# EAGLE design USB Sentinel (EAGLE 6.4)
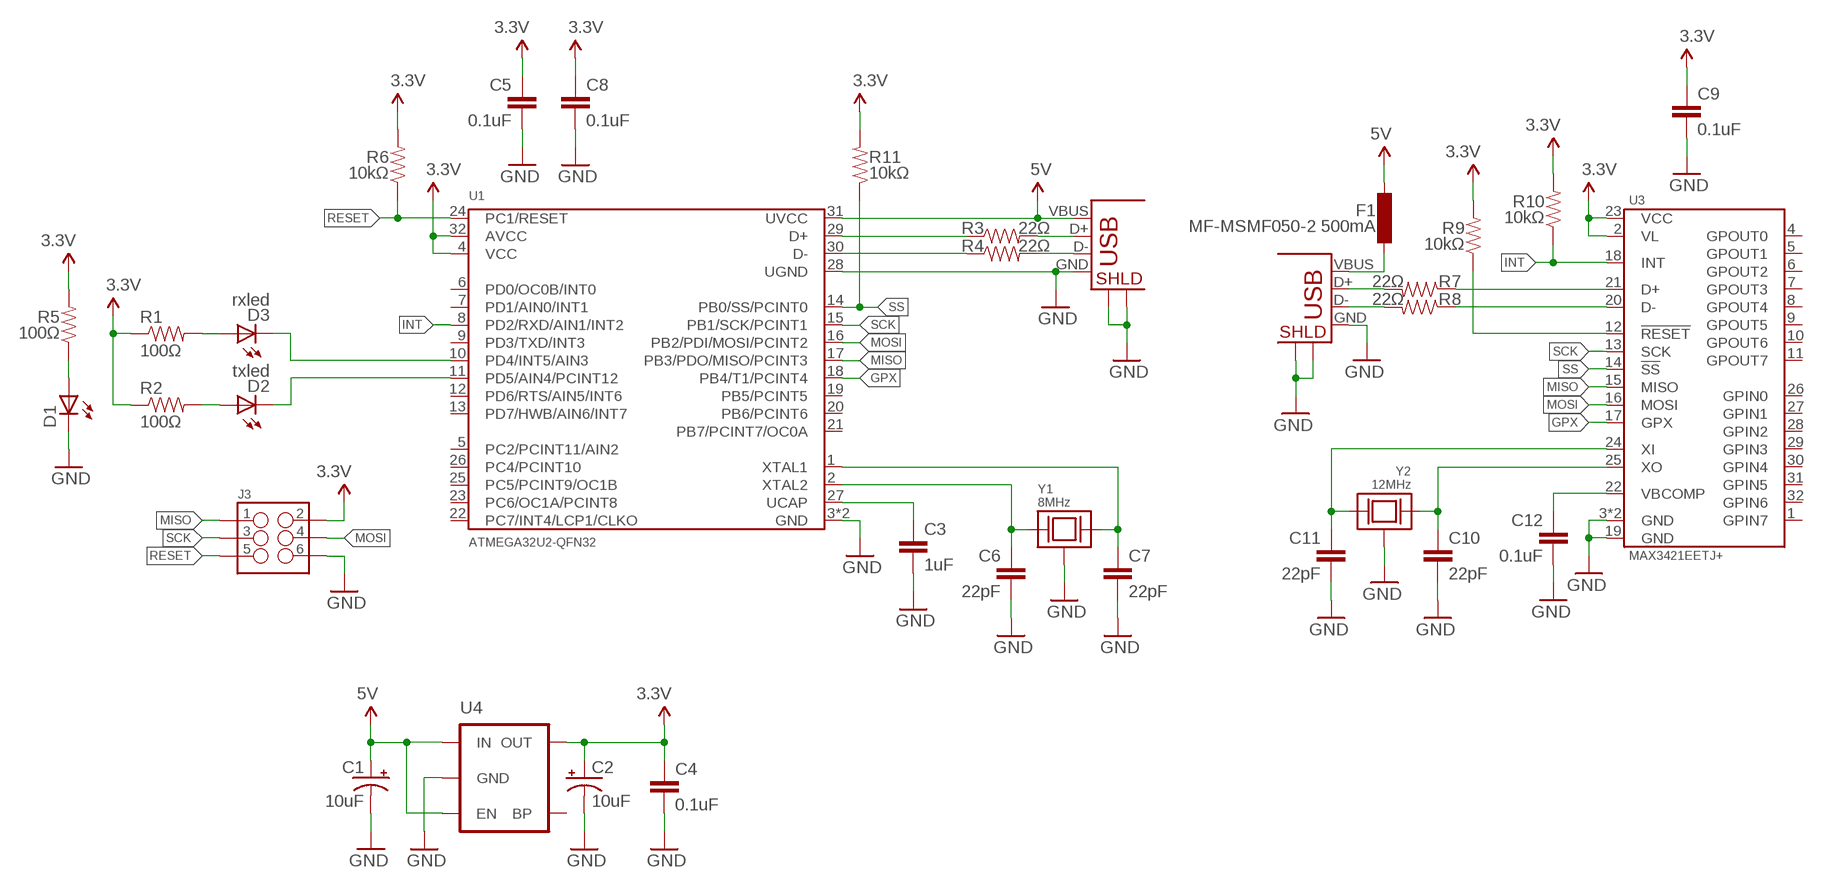
[diagram p0: schematic, sheet 1]

## Parts
C1  10uF  CAP_POL0805  [0805-CAP_POL]
C2  10uF  CAP_POL0805  [0805-CAP_POL]
C3  1uF  CAP0402-CAP  [0402-CAP]
C4  0.1uF  CAP0402-CAP  [0402-CAP]
C5  0.1uF  CAP0402-CAP  [0402-CAP]
C6  22pF  CAP0402-CAP  [0402-CAP]
C7  22pF  CAP0402-CAP  [0402-CAP]
C8  0.1uF  CAP0402-CAP  [0402-CAP]
C9  0.1uF  CAP0402-CAP  [0402-CAP]
C10  22pF  CAP0402-CAP  [0402-CAP]
C11  22pF  CAP0402-CAP  [0402-CAP]
C12  0.1uF  CAP0402-CAP  [0402-CAP]
D1  LED0603  [LED-0603]
D2  txled  LED0603  [LED-0603]
D3  rxled  LED0603  [LED-0603]
F1  MF-MSMF050-2 500mA  L-EUL1812  [L1812]
J1  USB+SHIELD-MICROB  [USB-MICROB]
J2  USB+SHIELD-A-S  [USB-A-S]
J3  M03X2-50MIL  [M03X2-50MIL]
R1  100Ω  RESISTOR0402-RES  [0402-RES]
R2  100Ω  RESISTOR0402-RES  [0402-RES]
R3  22Ω  RESISTOR0402-RES  [0402-RES]
R4  22Ω  RESISTOR0402-RES  [0402-RES]
R5  100Ω  RESISTOR0402-RES  [0402-RES]
R6  10kΩ  RESISTOR0402-RES  [0402-RES]
R7  22Ω  RESISTOR0402-RES  [0402-RES]
R8  22Ω  RESISTOR0402-RES  [0402-RES]
R9  10kΩ  RESISTOR0402-RES  [0402-RES]
R10  10kΩ  RESISTOR0402-RES  [0402-RES]
R11  10kΩ  RESISTOR0402-RES  [0402-RES]
U1  ATMEGA32U2-QFN32  [QFN-32]
U3  MAX3421EETJ+  [QFN-32]
U4  V_REG_LDOSMD  [SOT23-5]
Y1  8MHz  CRYSTAL-5X3.2  [CRYSTAL-5X3.2]
Y2  12MHz  CRYSTAL-ECX32  [ECX-32]

## Nets
3.3V: C2.A(+) C4.1 C5.1 C8.1 C9.1 J3.2 R1.1 R2.1 R5.2 R6.2 R9.2 R10.2 R11.2 U1.4(VCC) U1.32(AVCC) U3.2(VL) U3.23(VCC) U4.5(OUT)
5V: C1.A(+) F1.1 J1.VBUS U1.31(UVCC) U4.1(IN) U4.3(EN)
GND: C1.C(-) C2.C(-) C3.2 C4.2 C5.2 C6.2 C7.2 C8.2 C9.2 C10.2 C11.2 C12.2 D1.C J1.GND J1.MT1 J1.MT2 J1.P$1 J1.P$2 J2.GND J2.P$5 J2.P$6 J3.6 U1.3(GND) U1.28(UGND) U1.EP(GND) U3.3(GND) U3.19(GND) U3.EP(GND) U4.2(GND) Y1.2(GND) Y1.4(GND) Y2.2(GND) Y2.4(GND)
GPX: U1.18(PB4/T1/PCINT4) U3.17(GPX)
INT: R10.1 U1.8(PD2/RXD/AIN1/INT2) U3.18(INT)
MISO: J3.1 U1.17(PB3/PDO/MISO/PCINT3) U3.15(MISO)
MOSI: J3.4 U1.16(PB2/PDI/MOSI/PCINT2) U3.16(MOSI)
N$1: C3.1 U1.27(UCAP)
N$2: D3.C U1.10(PD4/INT5/AIN3)
N$3: D2.C U1.11(PD5/AIN4/PCINT12)
N$4: D3.A R1.2
N$5: D2.A R2.2
N$6: R3.1 U1.29(D+)
N$7: R4.1 U1.30(D-)
N$8: J1.D+ R3.2
N$9: J1.D- R4.2
N$10: D1.A R5.1
N$11: F1.2 J2.VBUS
N$12: J2.D+ R7.2
N$13: J2.D- R8.2
N$14: R7.1 U3.21(D+)
N$15: R8.1 U3.20(D-)
N$16: C10.1 U3.25(XO) Y2.1
N$17: C11.1 U3.24(XI) Y2.3
N$18: C12.1 U3.22(VBCOMP)
N$24: R9.1 U3.12(!RESET)
N$25: C6.1 U1.2(XTAL2) Y1.1
N$26: C7.1 U1.1(XTAL1) Y1.3
RESET: J3.5 R6.1 U1.24(PC1/RESET)
SCK: J3.3 U1.15(PB1/SCK/PCINT1) U3.13(SCK)
SS: R11.1 U1.14(PB0/SS/PCINT0) U3.14(!SS)
Unconnected: U1.5(PC2/PCINT11/AIN2) U1.6(PD0/OC0B/INT0) U1.7(PD1/AIN0/INT1) U1.9(PD3/TXD/INT3) U1.12(PD6/RTS/AIN5/INT6) U1.13(PD7/HWB/AIN6/INT7) U1.19(PB5/PCINT5) U1.20(PB6/PCINT6) U1.21(PB7/PCINT7/OC0A) U1.22(PC7/INT4/LCP1/CLKO) U1.23(PC6/OC1A/PCINT8) U1.25(PC5/PCINT9/OC1B) U1.26(PC4/PCINT10) U3.1(GPIN7) U3.4(GPOUT0) U3.5(GPOUT1) U3.6(GPOUT2) U3.7(GPOUT3) U3.8(GPOUT4) U3.9(GPOUT5) U3.10(GPOUT6) U3.11(GPOUT7) U3.26(GPIN0) U3.27(GPIN1) U3.28(GPIN2) U3.29(GPIN3) U3.30(GPIN4) U3.31(GPIN5) U3.32(GPIN6) U4.4(BP)

## Library data of the parts
C1 C2 = SparkFun-Passives:CAP_POL: Capacitor Polarized These are standard SMD and PTH capacitors. Normally 10uF, 47uF, and 100uF in electrolytic and tantalum varieties. Always verify the external diameter of the through hole cap, it varies with capacity, voltage, and manufacturer. The EIA devices should be standard.
C3-C12 = SparkFun-Passives:CAP: Capacitor Standard 0603 ceramic capacitor, and 0.1" leaded capacitor.
D1-D3 = SparkFun-LED:LED: LEDs Standard schematic elements and footprints for 5mm, 3mm, 1206, and 0603 sized LEDs. 5mm - Spark Fun Electronics SKU : COM-00529 (and others)
F1 = rcl:L-EU: INDUCTOR, European symbol
J1 J2 = SparkFun-Connectors:USB+SHIELD: USB+Shield USB connector with shield pins connectable
J3 = SparkFun-Connectors:M03X2: 2x3 .1" header. Shrouded, with keying- CONN-10681 SMT- CONN-11415 Pogo pins- HW-11044
R1-R11 = SparkFun-Passives:RESISTOR: Resistor Basic schematic elements and footprints for 0603, 1206, and PTH resistors.
U1 = Atmel:ATMEGA32U2
U3 = Maxim:MAX3421
U4 = SparkFun-PowerIC:V_REG_LDO: Voltage Regulator LDO Standard 150mA LDO voltage regulator in SOT-23 layout. Micrel part MIC5205. BP (by-pass) pin is used to lower output noise with 470pF cap.
Y1 Y2 = work:CRYSTAL

## Board
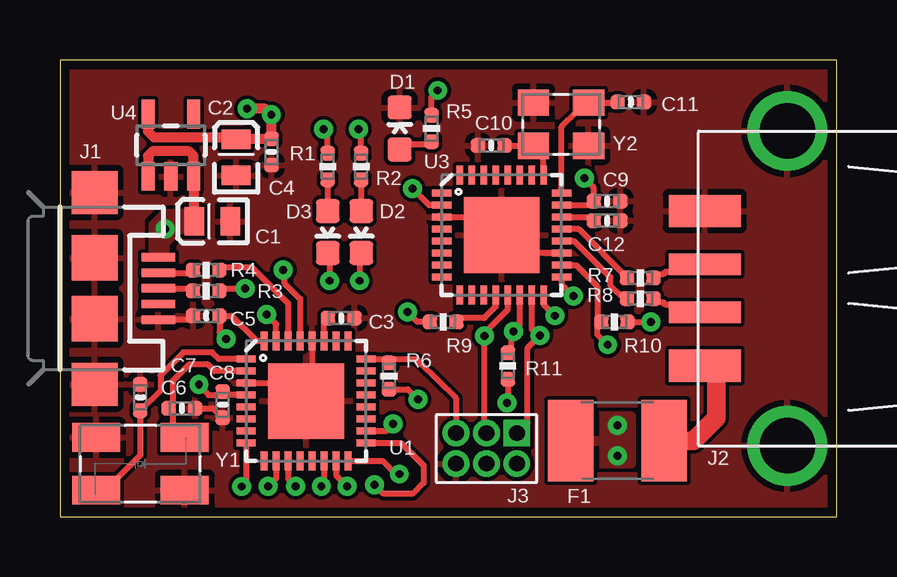
[diagram p1: board, top side]
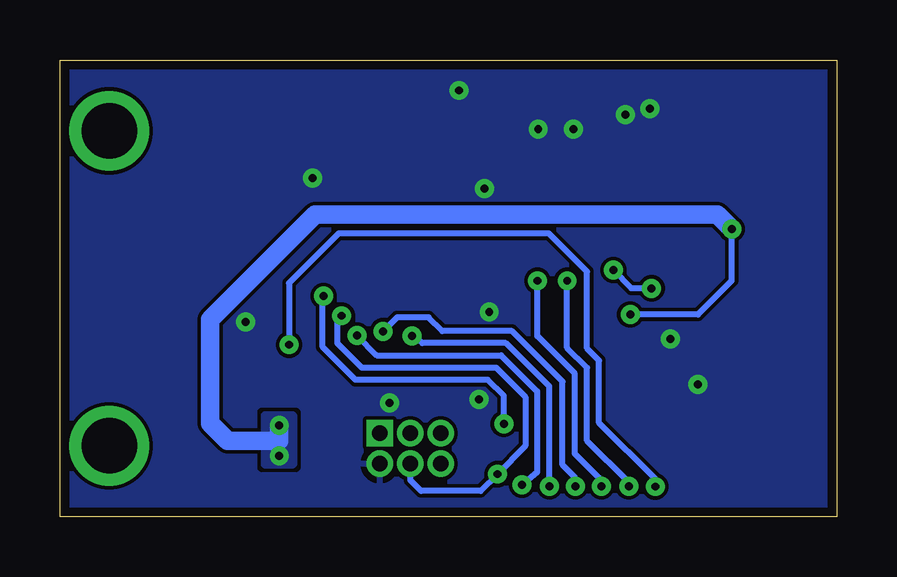
[diagram p2: board, bottom side, seen from below]

Size 32.38 x 19.05 mm. Coordinates in mm from the lower left corner, seen from the top.
Outline: 0,0 32.38,0 32.38,19.05 0,19.05 0,0
Copper layers (1*16): Top 0.0356mm / dielectric 1.5011mm / Bottom 0.0356mm
Design rules "LaenPCBOrder *": minimum track width 6mil, minimum drill 13mil, track to track 6mil, track to pad 6mil, pad to pad 6mil, via to via 6mil, smd to smd 6mil, copper to edge 15mil, drill to drill 6mil, minimum pad ring 9mil, minimum via ring 9mil, stop-mask expansion 4mil, vias tented up to drill 15mil, thermal gap 10mil

### Footprints (pad centres in the part's own frame; a part is rotated, then mirrored left to right if it is on the bottom)
0805-CAP_POL = smd 0.8 x 1.2: A 0.75,0; C -0.75,0
0402-CAP = smd 0.6 x 0.6: 1 -0.55,0; 2 0.55,0
LED-0603 = smd 1 x 1: A 0,-0.877; C 0,0.877
L1812 = smd 1.9 x 3.4: 1 -1.95,0; 2 1.95,0
USB-MICROB = smd 0.35 x 1.4: D+ 0,2.65; D- -0.65,2.65; GND 1.3,2.65; ID 0.65,2.65; VBUS -1.3,2.65 | smd 1.8 x 1.9: MT1 -4,0; MT2 4,0 | smd 1.9 x 1.9: P$1 -1.27,0; P$2 1.27,0
USB-A-S = smd 3 x 0.9: D+ 3.45,-1; D- 3.45,1 | smd 3 x 1.35: GND 3.45,-3.225; VBUS 3.45,3.225 | drill 2.311: P$5 0,-6.566; P$6 0,6.566
M03X2-50MIL = drill 0.65 pad 0.914 square: 1 -1.27,-0.635 | drill 0.65 pad 0.914: 2 -1.27,0.635; 3 0,-0.635; 4 0,0.635; 5 1.27,-0.635; 6 1.27,0.635
0402-RES = smd 0.6 x 0.6: 1 -0.55,0; 2 0.55,0
QFN-32 = smd 0.285 x 0.8: 1 -1.75,-2.5; 2 -1.25,-2.5; 3 -0.75,-2.5; 4 -0.25,-2.5; 5 0.25,-2.5; 6 0.75,-2.5; 7 1.25,-2.5; 8 1.75,-2.5; 17 1.75,2.5; 18 1.25,2.5; 19 0.75,2.5; 20 0.25,2.5; 21 -0.25,2.5; 22 -0.75,2.5; 23 -1.25,2.5; 24 -1.75,2.5 | smd 0.8 x 0.285: 9 2.5,-1.75; 10 2.5,-1.25; 11 2.5,-0.75; 12 2.5,-0.25; 13 2.5,0.25; 14 2.5,0.75; 15 2.5,1.25; 16 2.5,1.75; 25 -2.5,1.75; 26 -2.5,1.25; 27 -2.5,0.75; 28 -2.5,0.25; 29 -2.5,-0.25; 30 -2.5,-0.75; 31 -2.5,-1.25; 32 -2.5,-1.75 | smd 3.15 x 3.15: EP 0,0
SOT23-5 = smd 0.55 x 1.2: 1 -0.95,-1.3; 2 0,-1.3; 3 0.95,-1.3; 4 0.95,1.3; 5 -0.95,1.3
CRYSTAL-5X3.2 = smd 2 x 1.2: 1 -1.85,-1.1; 2 1.85,-1.1; 3 1.85,1.1; 4 -1.85,1.1
ECX-32 = smd 1.3 x 1.1: 1 -1.15,-0.9; 2 1.15,-0.9; 3 1.15,0.9; 4 -1.15,0.9

### Placement (x,y rotation side)
C1  6.35,12.32 180 top
C2  7.34,14.99 90 top
C3  11.72,8.28 0 top
C4  8.81,15.21 270 top
C5  6.1,8.38 180 top
C6  5.08,4.52 0 top
C7  3.35,4.98 90 top
C8  6.78,4.67 270 top
C9  22.81,13.16 0 top
C10  17.98,15.48 180 top
C11  23.8,17.3 0 top
C12  22.81,12.34 0 top
D1  14.16,16.19 0 top
D2  12.56,11.87 180 top
D3  11.16,11.87 180 top
F1  23.24,3.17 0 top
J1  1.45,9.53 270 top
J2  30.33,9.53 180 top
J3  17.78,2.84 180 top
R1  11.16,14.61 270 top
R2  12.56,14.61 270 top
R3  6.1,9.42 180 top
R4  6.1,10.28 180 top
R5  15.49,16.19 90 top
R6  13.72,5.87 270 top
R7  24.19,9.96 0 top
R8  24.19,9.09 0 top
R9  15.98,8.13 180 top
R10  23.11,8.13 0 top
R11  18.67,6.29 270 top
U1  10.26,4.83 270 top
U3  18.41,11.75 270 top
U4  4.62,15.49 0 top
Y1  3.35,2.21 180 top
Y2  20.89,16.37 0 top

### Tracks (layer width: path | path; a pad name or v marks a point on that pad's centre or on a via)
3.3V  (via drill 0.33)
  Top 0.254: U1.32 8.22,7.33 7.16,8.38 C5.1 6.65,7.71 v6.93,7.42 | U3.2 15.39,13 v14.69,13.69 | R10.2 v24.64,8.13 | R5.2 15.49,17.53 v15.75,17.78 | U3.23 22.26,13 C9.1 22.26,13.72 v21.86,14.12 | R9.2 14.9,8.13 v14.49,8.53 | R11.2 18.67,4.78 v18.64,4.75 | R6.2 14.49,5.32 v14.92,4.89 | R2.1 12.56,16.05 v12.45,16.17 | R1.1 11.16,15.99 v10.99,16.17 | U1.4 6.94,5.08 C8.1 6.78,5.08 6.2,5.08 v5.79,5.51
  Top 0.406: U4.5 3.67,16.06 3.91,15.82 7.24,15.82 7.33,15.74 C2.A 7.37,15.76 8.71,15.76 C4.1 v8.81,16.76 8.56,17.02 v7.8,17.02
  pour Bottom (rank 2): -2.54,21.59 -2.54,-2.54 34.92,-2.54 34.92,21.59
5V  (via drill 0.33)
  Top 0.254: U1.31 9.01,8.03 v8.61,8.43
  Top 0.406: U4.1 3.67,15.05 3.86,15.24 5.38,15.24 5.57,15.05 U4.3 5.57,12.35 C1.A
  Bottom 0.254: v4.38,12 4.38,9.84 5.79,8.43 v8.61,8.43
  Bottom 0.762: v4.38,12 4.98,12.6 21.75,12.6 26.12,8.23 26.12,3.9 25.4,3.17 23.24,3.17 v23.24,3.81
  other vias: 23.24,2.54
  pour Bottom: 22.69,4.19 23.81,4.19 23.81,2.22 22.69,2.22
  pour Top (no thermals): 3.81,10.79 4.45,10.79 4.45,11.37 5.02,11.94 5.84,11.94 5.84,12.7 4.32,12.7 3.81,12.19
  pour Top: 23.81,4.19 21.4,4.19 21.4,2.22 23.81,2.22
GND
  Top 0.254: U1.28 10.51,5.08 U1.EP 9.51,5.58 U1.3 | J1.GND 5.55,8.22 C5.2 | U3.19 19.16,11 U3.EP 17.66,12.5 U3.3 | C6.2 6.38,4.52 C8.2
  pour Top (rank 2): -1.27,20.32 33.66,20.32 33.66,-1.27 -1.27,-1.27
GPX  (via drill 0.33)
  Top 0.254: U1.18 13.58,3.58 v13.88,3.87 | U3.17 20.91,9.69 v21.4,9.21
  Bottom 0.254: v13.88,3.87 13.88,5.05 14.54,5.71 20.07,5.71 21.43,7.08 21.43,9.18 v21.4,9.21
INT  (via drill 0.33)
  Top 0.254: U3.18 21.51,10.5 22.4,9.6 22.4,8.29 R10.1 22.56,8.04 22.4,8.05 22.4,7.61 v22.84,7.18 | U1.8 7.76,1.45 v7.57,1.26
  Bottom 0.254: v7.57,1.26 7.57,1.57 9.91,3.91 9.91,6.51 10.41,7.02 10.41,10.22 12,11.81 20.77,11.81 22.84,9.74 v22.84,7.18
MISO  (via drill 0.33)
  Top 0.254: U3.15 19.66,7.83 v20,7.56 19.49,7.05 19.49,3.92 J3.1 | v13.12,1.33 13.49,0.96 14.71,0.96 15.16,1.41 15.16,2.13 14.22,3.08 U1.17
  Bottom 0.254: v20,7.56 19.18,6.73 14,6.73 12.49,5.23 12.49,1.86 v13.12,1.33
MOSI  (via drill 0.33)
  Top 0.254: U1.16 13.46,2.33 14.01,1.78 v14.15,1.78 | U3.16 20.16,8.85 v20.64,8.38
  Bottom 0.254: J3.4 17.78,1.53 17.33,1.08 14.85,1.08 v14.15,1.78 12.98,2.95 12.98,5 14.2,6.22 19.81,6.22 20.83,7.24 20.83,8.19 v20.64,8.38
N$1
  Top 0.254: U1.27 11.01,8.28 C3.1
N$2  (via drill 0.33)
  Top 0.254: v8.67,1.27 9.01,1.61 U1.10 | D3.C 11.24,10.92 v11.24,9.84
  Bottom 0.254: v8.67,1.27 8.69,1.45 10.41,3.17 10.41,6.22 11.24,7.05 v11.24,9.84
N$3  (via drill 0.33)
  Top 0.254: U1.11 9.51,1.57 v9.82,1.27 | D2.C 12.48,10.92 v12.48,9.84
  Bottom 0.254: v9.82,1.27 9.72,1.42 10.92,2.63 10.92,5.97 12.48,7.53 v12.48,9.84
N$4
  Top 0.254: R1.2 D3.A
N$5
  Top 0.254: R2.2 D2.A
N$6  (via drill 0.33)
  Top 0.254: R3.1 6.75,9.53 v7.72,9.53 | v9.31,10.29 9.37,10.22 9.37,9.73 10.01,9.09 U1.29
  Bottom 0.254: v7.72,9.53 8.57,9.53 v9.31,10.29
N$7
  Top 0.254: U1.30 9.51,8.89 7.98,10.41 6.75,10.41 R4.1
N$8
  Top 0.254: J1.D+ 5.45,9.53 R3.2
N$9
  Top 0.254: J1.D- 5.45,10.18 R4.2
N$10
  Top 0.254: D1.A 14.39,15.54 15.39,15.54 R5.1
N$11
  Top 0.762: J2.VBUS 27.37,6.53 27.37,4.13 26.41,3.17 F1.2
N$12
  Top 0.254: J2.D+ 26.56,10.21 25.25,10.21 25.15,10.11 24.92,10.11 24.77,9.96 R7.2
N$13
  Top 0.254: J2.D- 26.56,8.84 25.25,8.84 25.15,8.94 24.82,8.94 24.74,9.01 R8.2
N$14
  Top 0.254: U3.21 21.63,12 23.64,9.98 R7.1
N$15
  Top 0.254: U3.20 21.43,11.5 22.95,9.98 22.95,9.63 23.48,9.09 R8.1
N$16
  Top 0.254: U3.25 20.16,15.05 Y2.1 C10.1
N$17
  Top 0.254: U3.24 20.91,16.27 21.59,16.94 21.71,16.94 Y2.3 23.35,17.27 C11.1
N$18
  Top 0.254: U3.22 22.12,12.5 C12.1
N$24
  Top 0.254: U3.12 18.16,8.77 17.68,8.28 16.68,8.28 R9.1
N$25
  Top 0.254: U1.2 6.45,6.08 6.17,6.35 5.38,6.35 4.69,5.66 4.69,4.69 C6.1 4.7,4.52 4.7,3.63 5.2,3.63 Y1.1
N$26
  Top 0.254: U1.1 6.63,6.58 6.35,6.86 5.16,6.86 4.19,5.89 4.19,5.27 C7.1 3.35,2.56 2.06,1.27 1.66,1.27 Y1.3
RESET
  Top 0.254: U1.24 13.63,6.58 R6.1 13.72,6.58 14.86,6.58 15.02,6.42 16.51,4.95 J3.5
SCK  (via drill 0.33)
  Top 0.254: U1.15 11.51,1.73 v11.98,1.27 | U3.13 18.66,8.63 17.7,7.67 v17.7,7.54 17.7,3.56 J3.3
  Bottom 0.254: v11.98,1.27 11.99,1.38 11.99,5.43 13.79,7.24 17.27,7.24 v17.7,7.54
SS  (via drill 0.33)
  Top 0.254: U1.14 11.01,1.39 v10.9,1.27 | U3.14 19.16,7.99 v18.91,7.73 18.8,7.62 18.8,6.86 18.77,6.84 R11.1
  Bottom 0.254: v18.91,7.73 18.33,8.31 17.01,8.31 16.45,7.75 13.54,7.75 11.43,5.64 11.43,2.16 10.9,1.63 v10.9,1.27